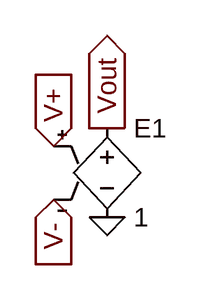
[diagram p0: schematic subtractor.asc]
subtractor.asc, the LTspice schematic file:
Version 4
SHEET 1 880 680
FLAG 304 144 V+
IOPIN 304 144 In
FLAG 304 192 V-
IOPIN 304 192 In
FLAG 352 128 Vout
IOPIN 352 128 Out
FLAG 352 208 0
SYMBOL e 352 112 R0
SYMATTR InstName E1
SYMATTR Value 1

The netlist it stands for:
* subtractor.asc
E1 Vout 0 V+ V- 1
.backanno
.end